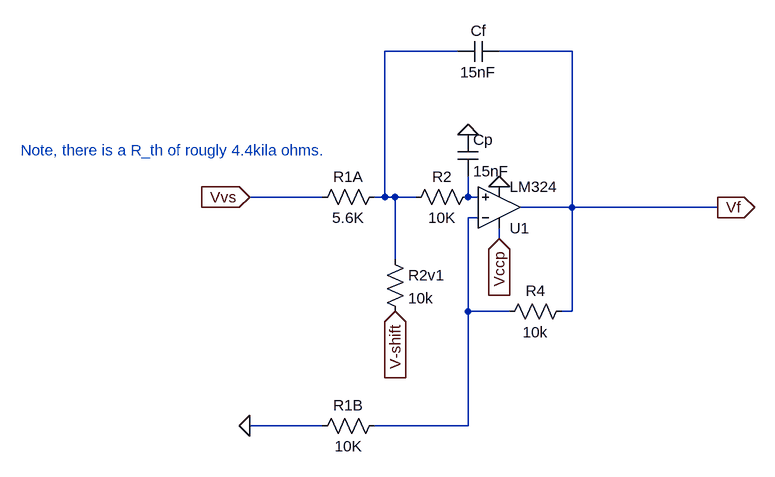
[diagram p0: schematic sig_cond-2ord.asc]
sig_cond-2ord.asc, the LTspice schematic file:
Version 4.1
SHEET 1 880 680
WIRE -864 -3824 -976 -3824
WIRE -688 -3824 -800 -3824
WIRE -1072 -3600 -1184 -3600
WIRE -976 -3600 -976 -3824
WIRE -976 -3600 -992 -3600
WIRE -960 -3600 -976 -3600
WIRE -928 -3600 -960 -3600
WIRE -848 -3600 -848 -3632
WIRE -832 -3600 -848 -3600
WIRE -688 -3584 -688 -3824
WIRE -688 -3584 -768 -3584
WIRE -464 -3584 -688 -3584
WIRE -832 -3568 -848 -3568
WIRE -800 -3536 -800 -3552
WIRE -960 -3504 -960 -3600
WIRE -848 -3424 -848 -3568
WIRE -784 -3424 -848 -3424
WIRE -688 -3424 -688 -3584
WIRE -688 -3424 -704 -3424
WIRE -1072 -3248 -1184 -3248
WIRE -848 -3248 -848 -3424
WIRE -848 -3248 -992 -3248
FLAG -464 -3584 Vf
IOPIN -464 -3584 Out
FLAG -1184 -3600 Vvs
IOPIN -1184 -3600 In
FLAG -960 -3424 V-shift
IOPIN -960 -3424 In
FLAG -800 -3536 Vccp
IOPIN -800 -3536 In
FLAG -800 -3616 0
FLAG -1184 -3248 0
FLAG -848 -3696 0
SYMBOL OpAmps\\opamp2 -800 -3520 M180
SYMATTR InstName U1
SYMATTR Value LM324
SYMBOL res -976 -3616 R90
WINDOW 0 0 56 VBottom 2
WINDOW 3 32 56 VTop 2
SYMATTR InstName R1A
SYMATTR Value 5.6K
SYMBOL res -688 -3440 R90
WINDOW 0 0 56 VBottom 2
WINDOW 3 32 56 VTop 2
SYMATTR InstName R4
SYMATTR Value 10k
SYMBOL res -976 -3264 R90
WINDOW 0 0 56 VBottom 2
WINDOW 3 32 56 VTop 2
<<<<<<< HEAD
SYMATTR InstName R2g
=======
SYMATTR InstName R1B
>>>>>>> b50d384b78e713e7427b0f54554ea35b88b9f067
SYMATTR Value 10K
SYMBOL res -976 -3520 R0
SYMATTR InstName R2v1
SYMATTR Value 10k
SYMBOL cap -864 -3696 R0
SYMATTR InstName Cp
SYMATTR Value 15nF
SYMBOL cap -800 -3840 R90
WINDOW 0 0 32 VBottom 2
WINDOW 3 32 32 VTop 2
SYMATTR InstName Cf
SYMATTR Value 15nF
SYMBOL res -832 -3616 R90
WINDOW 0 0 56 VBottom 2
WINDOW 3 32 56 VTop 2
SYMATTR InstName R2
SYMATTR Value 10K
TEXT -1536 -3672 Left 2 ;Note, there is a R_th of rougly 4.4kila ohms.

The netlist it stands for:
* sig_cond-2ord.asc
X§U1 N002 N003 Vccp 0 Vf LM324  ; pins In+ In- V+ V- OUT
R1A N001 Vvs 5.6K
R4 Vf N003 10k
R1B N003 0 10K
R2v1 N001 V-shift 10k
Cp 0 N002 15nF
Cf Vf N001 15nF
R2 N002 N001 10K
* Note, there is a R_th of rougly 4.4kila ohms.
.backanno
.end